# Altium schematic sheet MCU023_MSP432E_GPIO_USB.SchDoc
size 431 x 279 mm; Date: Not shown in title block; ApprovedBy: Not shown in title block; CheckedBy: Not shown in title block; Author: Not shown in title block; CompanyName: Not shown in title block; Engineer: Not shown in title block; Organization: Not shown in title block; Address1: Not shown in title block; Address2: Not shown in title block; Address3: Not shown in title block; Address4: Not shown in title block; DocumentNumber: 1; Revision: Use project parameter SCH_Rev; SheetNumber: 1; SheetTotal: 6; PageSetup: Record=PageOptions|CenterHorizontal=True|CenterVertical=True|PrintScale=1.00|XCorrection=1.00|YCorrection=1.00|PrintKind=0|BorderSize=5000000|LeftOffset=0|BottomOffset=0|Orientation=2|PaperLength=1000|PaperWidth=1000|Scale=100|PaperSource=15|PrintQuality=600|MediaType=1|DitherType=10|PaperKind=Letter|PrintScaleMode=1; CurrentTime: Not shown in title block; CurrentDate: Not shown in title block; Time: Not shown in title block; DocumentFullPathAndName: Not shown in title block; DocumentName: Not shown in title block; ModifiedDate: Not shown in title block; ImagePath: Not shown in title block
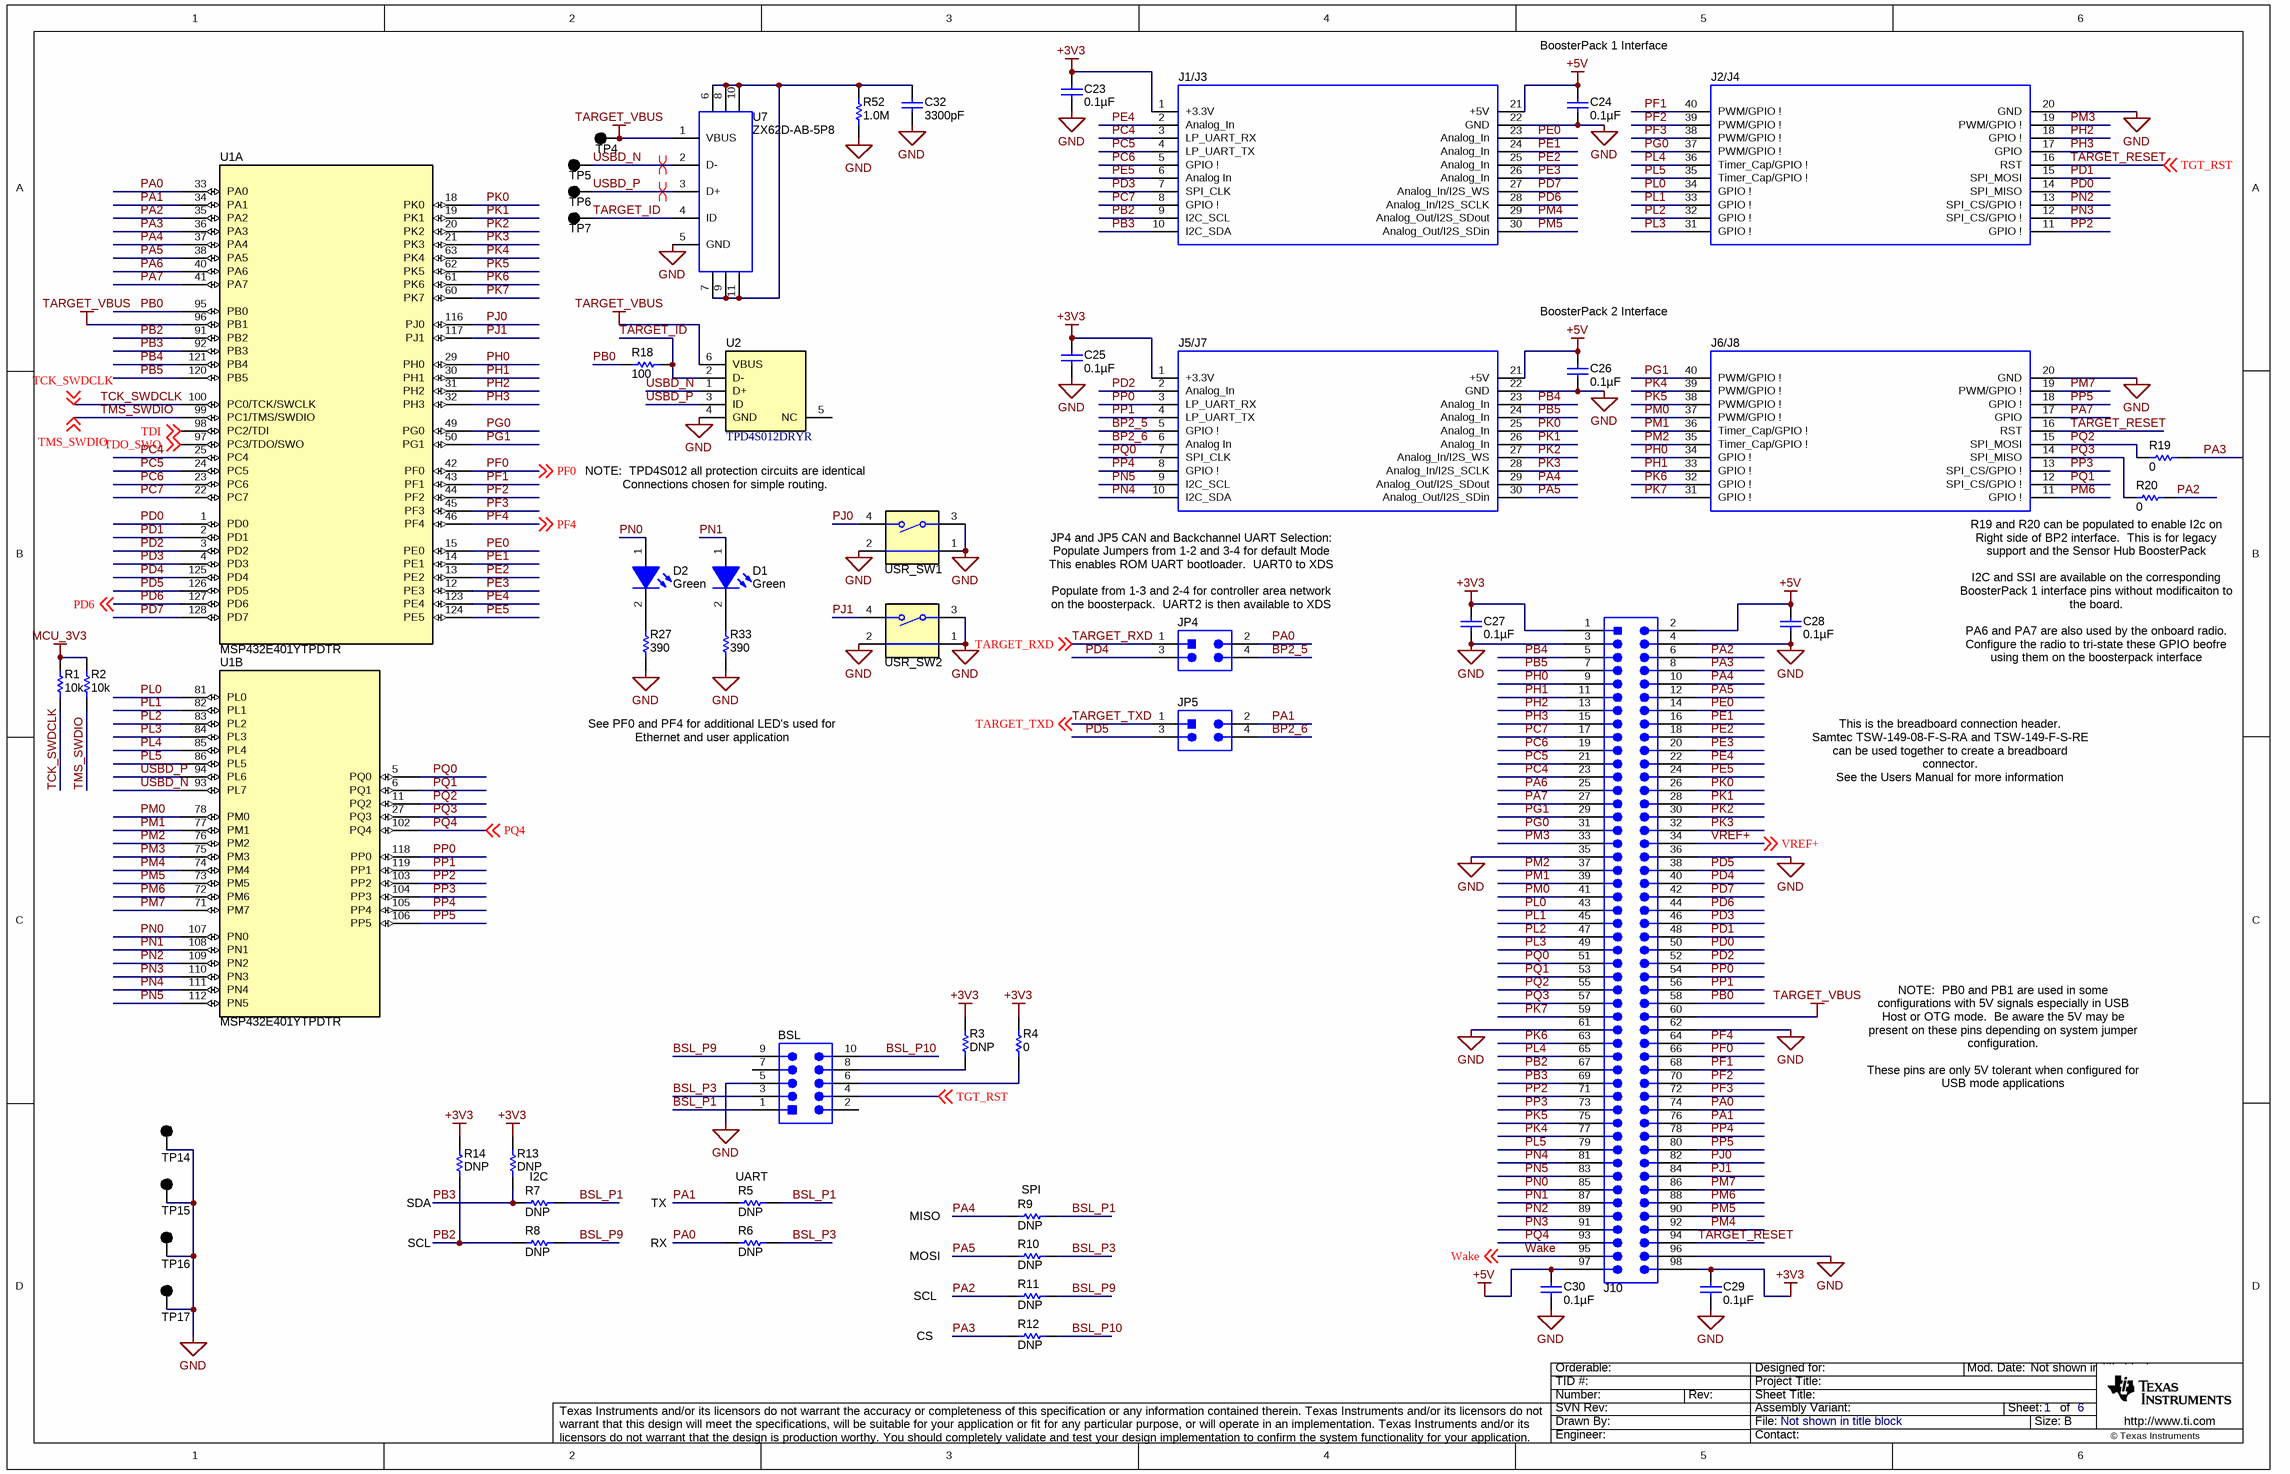
[diagram p0: MCU023_MSP432E_GPIO_USB.SchDoc]

## Parts
BSL  AWHW-10G-0202-T  [Assman_AWHW-10G-0x02-T]  (value not drawn)
C23  ValueDisplayed: 0.1µF  [0402]  (hidden comment: GRM155R71C104KA88D)
C24  ValueDisplayed: 0.1µF  [0402]  (hidden comment: GRM155R71C104KA88D)
C25  ValueDisplayed: 0.1µF  [0402]  (hidden comment: GRM155R71C104KA88D)
C26  ValueDisplayed: 0.1µF  [0402]  (hidden comment: GRM155R71C104KA88D)
C27  ValueDisplayed: 0.1µF  [0402]  (hidden comment: GRM155R71C104KA88D)
C28  ValueDisplayed: 0.1µF  [0402]  (hidden comment: GRM155R71C104KA88D)
C29  ValueDisplayed: 0.1µF  [0402]  (hidden comment: GRM155R71C104KA88D)
C30  ValueDisplayed: 0.1µF  [0402]  (hidden comment: GRM155R71C104KA88D)
C32  ValueDisplayed: 3300pF  [0603]  (hidden comment: GRM188R71H332KA01D)
D1  value Green  [LED_LTST-C190]  (hidden comment: LTST-C190GKT)
D2  value Green  [LED_LTST-C190]  (hidden comment: LTST-C190GKT)
J1/J3  SSQ-110-03-T-D  [BoosterPack_40pin_J1J3]  (value not drawn)
J2/J4  SSQ-110-03-T-D  [BoosterPack_40pin_J2J4]  (value not drawn)
J5/J7  SSQ-110-03-T-D  [BoosterPack_40pin_J1J3]  (value not drawn)
J6/J8  SSQ-110-03-T-D  [BoosterPack_40pin_J2J4]  (value not drawn)
J10  TSW-149-07-S-D  [Samtec_TSW-149-07-x-D]  (value not drawn)
JP4  PBC02DAAN  [Sullins_PxC02DAAN]  (value not drawn)
JP5  PBC02DAAN  [Sullins_PxC02DAAN]  (value not drawn)
R1  ValueDisplayed: 10k  [0402]  (hidden comment: CRCW040210K0JNED)
R2  ValueDisplayed: 10k  [0402]  (hidden comment: CRCW040210K0JNED)
R3  ValueDisplayed: DNP  [0402]  (hidden comment: ERJ-2GE0R00X)
R4  ValueDisplayed: 0  [0402]  (hidden comment: ERJ-2GE0R00X)
R5  ValueDisplayed: DNP  [0402]  (hidden comment: ERJ-2GE0R00X)
R6  ValueDisplayed: DNP  [0402]  (hidden comment: ERJ-2GE0R00X)
R7  ValueDisplayed: DNP  [0402]  (hidden comment: ERJ-2GE0R00X)
R8  ValueDisplayed: DNP  [0402]  (hidden comment: ERJ-2GE0R00X)
R9  ValueDisplayed: DNP  [0402]  (hidden comment: ERJ-2GE0R00X)
R10  ValueDisplayed: DNP  [0402]  (hidden comment: ERJ-2GE0R00X)
R11  ValueDisplayed: DNP  [0402]  (hidden comment: ERJ-2GE0R00X)
R12  ValueDisplayed: DNP  [0402]  (hidden comment: ERJ-2GE0R00X)
R13  ValueDisplayed: DNP  [0402]  (hidden comment: CRCW04023K30JNED)
R14  ValueDisplayed: DNP  [0402]  (hidden comment: CRCW04023K30JNED)
R18  ValueDisplayed: 100  [0402]  (hidden comment: CRCW0402100RJNED)
R19  ValueDisplayed: 0  [0402]  (hidden comment: ERJ-2GE0R00X)
R20  ValueDisplayed: 0  [0402]  (hidden comment: ERJ-2GE0R00X)
R27  ValueDisplayed: 390  [0402]  (hidden comment: CRCW0402390RJNED)
R33  ValueDisplayed: 390  [0402]  (hidden comment: CRCW0402390RJNED)
R52  ValueDisplayed: 1.0M  [0603]  (hidden comment: CRCW06031M00JNEA)
TP4  5001  [Keystone5001]  (value not drawn)
TP5  5001  [Keystone5001]  (value not drawn)
TP6  5001  [Keystone5001]  (value not drawn)
TP7  5001  [Keystone5001]  (value not drawn)
TP14  5001  [Keystone5001]  (value not drawn)
TP15  5001  [Keystone5001]  (value not drawn)
TP16  5001  [Keystone5001]  (value not drawn)
TP17  5001  [Keystone5001]  (value not drawn)
U1  MSP432E401YTPDTR  [PDT0128A]  (parts A,B of 4)
U2  TPD4S012DRYR  [DRY0006A]
U7  ZX62D-AB-5P8  [Hirose-ZX62D-AB-5P8]
USR_SW1  1188E-1K2-V-TR  [SW_1188E]  (value not drawn)
USR_SW2  1188E-1K2-V-TR  [SW_1188E]  (value not drawn)

## Nets
+3V3: C23.2 C25.2 C27.2 C29.2 J1/J3.1(+3.3V) J5/J7.1(+3.3V) J10.1 J10.98 R3.2 R4.2 R13.2 R14.2
+5V: C24.2 C26.2 C28.2 C30.2 J1/J3.21(+5V) J5/J7.21(+5V) J10.2 J10.97
GND: BSL.5 C23.1 C24.1 C25.1 C26.1 C27.1 C28.1 C29.1 C30.1 C32.2 J1/J3.22(GND) J2/J4.20(GND) J5/J7.22(GND) J6/J8.20(GND) J10.3 J10.4 J10.35 J10.36 J10.61 J10.62 J10.96 R27.1 R33.1 R52.1 TP14.1 TP15.1 TP16.1 TP17.1 U2.4(GND) U7.5(GND) USR_SW1.1 USR_SW1.2 USR_SW1.3 USR_SW2.1 USR_SW2.2 USR_SW2.3
MCU_3V3: R1.2 R2.2
TARGET_VBUS: J10.60 TP4.1 U1.96(PB1) U2.6(VBUS) U7.1(VBUS)
BP2_5: J5/J7.5(GPIO_!) JP4.4
BP2_6: J5/J7.6(Analog_In) JP5.4
BSL_P1: BSL.1 R5.1 R7.1 R9.1
BSL_P3: BSL.3 R6.1 R10.1
BSL_P9: BSL.9 R8.1 R11.1
BSL_P10: BSL.10 R12.1
PA0: J10.74 JP4.2 R6.2 U1.33(PA0)
PA1: J10.76 JP5.2 R5.2 U1.34(PA1)
PA2: J10.6 R11.2 R20.2 U1.35(PA2)
PA3: J10.8 R12.2 R19.2 U1.36(PA3)
PA4: J5/J7.29(Analog_Out/I2S_SDout) J10.10 R9.2 U1.37(PA4)
PA5: J5/J7.30(Analog_Out/I2S_SDin) J10.12 R10.2 U1.38(PA5)
PA6: J10.25 U1.40(PA6)
PA7: J6/J8.17(GPIO) J10.27 U1.41(PA7)
PB0: J10.58 R18.1 U1.95(PB0)
PB2: J1/J3.9(I2C_SCL) J10.67 R8.2 R14.1 U1.91(PB2)
PB3: J1/J3.10(I2C_SDA) J10.69 R7.2 R13.1 U1.92(PB3)
PB4: J5/J7.23(Analog_In) J10.5 U1.121(PB4)
PB5: J5/J7.24(Analog_In) J10.7 U1.120(PB5)
PC4: J1/J3.3(LP_UART_RX) J10.23 U1.25(PC4)
PC5: J1/J3.4(LP_UART_TX) J10.21 U1.24(PC5)
PC6: J1/J3.5(GPIO_!) J10.19 U1.23(PC6)
PC7: J1/J3.8(GPIO_!) J10.17 U1.22(PC7)
PD0: J2/J4.14(SPI_MISO) J10.50 U1.1(PD0)
PD1: J2/J4.15(SPI_MOSI) J10.48 U1.2(PD1)
PD2: J5/J7.2(Analog_In) J10.52 U1.3(PD2)
PD3: J1/J3.7(SPI_CLK) J10.46 U1.4(PD3)
PD4: J10.40 JP4.3 U1.125(PD4)
PD5: J10.38 JP5.3 U1.126(PD5)
PD6: J1/J3.28(Analog_In/I2S_SCLK) J10.44 U1.127(PD6) ; off-sheet PD6
PD7: J1/J3.27(Analog_In/I2S_WS) J10.42 U1.128(PD7)
PE0: J1/J3.23(Analog_In) J10.14 U1.15(PE0)
PE1: J1/J3.24(Analog_In) J10.16 U1.14(PE1)
PE2: J1/J3.25(Analog_In) J10.18 U1.13(PE2)
PE3: J1/J3.26(Analog_In) J10.20 U1.12(PE3)
PE4: J1/J3.2(Analog_In) J10.22 U1.123(PE4)
PE5: J1/J3.6(Analog_In) J10.24 U1.124(PE5)
PF0: J10.66 U1.42(PF0) ; off-sheet PF0
PF1: J2/J4.40(PWM/GPIO_!) J10.68 U1.43(PF1)
PF2: J2/J4.39(PWM/GPIO_!) J10.70 U1.44(PF2)
PF3: J2/J4.38(PWM/GPIO_!) J10.72 U1.45(PF3)
PF4: J10.64 U1.46(PF4) ; off-sheet PF4
PG0: J2/J4.37(PWM/GPIO_!) J10.31 U1.49(PG0)
PG1: J6/J8.40(PWM/GPIO_!) J10.29 U1.50(PG1)
PH0: J6/J8.34(GPIO_!) J10.9 U1.29(PH0)
PH1: J6/J8.33(GPIO_!) J10.11 U1.30(PH1)
PH2: J2/J4.18(GPIO_!) J10.13 U1.31(PH2)
PH3: J2/J4.17(GPIO) J10.15 U1.32(PH3)
PJ0: J10.82 U1.116(PJ0) USR_SW1.4
PJ1: J10.84 U1.117(PJ1) USR_SW2.4
PK0: J5/J7.25(Analog_In) J10.26 U1.18(PK0)
PK1: J5/J7.26(Analog_In) J10.28 U1.19(PK1)
PK2: J5/J7.27(Analog_In/I2S_WS) J10.30 U1.20(PK2)
PK3: J5/J7.28(Analog_In/I2S_SCLK) J10.32 U1.21(PK3)
PK4: J6/J8.39(PWM/GPIO_!) J10.77 U1.63(PK4)
PK5: J6/J8.38(PWM/GPIO_!) J10.75 U1.62(PK5)
PK6: J6/J8.32(GPIO_!) J10.63 U1.61(PK6)
PK7: J6/J8.31(GPIO_!) J10.59 U1.60(PK7)
PL0: J2/J4.34(GPIO_!) J10.43 U1.81(PL0)
PL1: J2/J4.33(GPIO_!) J10.45 U1.82(PL1)
PL2: J2/J4.32(GPIO_!) J10.47 U1.83(PL2)
PL3: J2/J4.31(GPIO_!) J10.49 U1.84(PL3)
PL4: J2/J4.36(Timer_Cap/GPIO_!) J10.65 U1.85(PL4)
PL5: J2/J4.35(Timer_Cap/GPIO_!) J10.79 U1.86(PL5)
PM0: J6/J8.37(PWM/GPIO_!) J10.41 U1.78(PM0)
PM1: J6/J8.36(Timer_Cap/GPIO_!) J10.39 U1.77(PM1)
PM2: J6/J8.35(Timer_Cap/GPIO_!) J10.37 U1.76(PM2)
PM3: J2/J4.19(PWM/GPIO_!) J10.33 U1.75(PM3)
PM4: J1/J3.29(Analog_Out/I2S_SDout) J10.92 U1.74(PM4)
PM5: J1/J3.30(Analog_Out/I2S_SDin) J10.90 U1.73(PM5)
PM6: J6/J8.11(GPIO_!) J10.88 U1.72(PM6)
PM7: J6/J8.19(PWM/GPIO_!) J10.86 U1.71(PM7)
PN0: D2.1(A) J10.85 U1.107(PN0)
PN1: D1.1(A) J10.87 U1.108(PN1)
PN2: J2/J4.13(SPI_CS/GPIO_!) J10.89 U1.109(PN2)
PN3: J2/J4.12(SPI_CS/GPIO_!) J10.91 U1.110(PN3)
PN4: J5/J7.10(I2C_SDA) J10.81 U1.111(PN4)
PN5: J5/J7.9(I2C_SCL) J10.83 U1.112(PN5)
PP0: J5/J7.3(LP_UART_RX) J10.54 U1.118(PP0)
PP1: J5/J7.4(LP_UART_TX) J10.56 U1.119(PP1)
PP2: J2/J4.11(GPIO_!) J10.71 U1.103(PP2)
PP3: J6/J8.13(SPI_CS/GPIO_!) J10.73 U1.104(PP3)
PP4: J5/J7.8(GPIO_!) J10.78 U1.105(PP4)
PP5: J6/J8.18(GPIO_!) J10.80 U1.106(PP5)
PQ0: J5/J7.7(SPI_CLK) J10.51 U1.5(PQ0)
PQ1: J6/J8.12(SPI_CS/GPIO_!) J10.53 U1.6(PQ1)
PQ2: J6/J8.15(SPI_MOSI) J10.55 R19.1 U1.11(PQ2)
PQ3: J6/J8.14(SPI_MISO) J10.57 R20.1 U1.27(PQ3)
PQ4: J10.93 U1.102(PQ4) ; off-sheet PQ4
TARGET_ID: R18.2 TP7.1 U2.2(D-) U7.4(ID)
TARGET_RESET: BSL.4 J2/J4.16(RST) J6/J8.16(RST) J10.94 ; off-sheet TGT_RST  [also labelled TGT_RST]
TARGET_RXD: JP4.1 ; off-sheet TARGET_RXD
TARGET_TXD: JP5.1 ; off-sheet TARGET_TXD
TCK_SWDCLK: R1.1 U1.100(PC0/TCK/SWCLK) ; off-sheet TCK_SWDCLK
TDI: U1.98(PC2/TDI) ; off-sheet TDI
TDO_SWO: U1.97(PC3/TDO/SWO) ; off-sheet TDO_SWO
TMS_SWDIO: R2.1 U1.99(PC1/TMS/SWDIO) ; off-sheet TMS_SWDIO
USBD_N: TP5.1 U1.93(PL7) U2.1(D+) U7.2(D-)
USBD_P: TP6.1 U1.94(PL6) U2.3(ID) U7.3(D+)
VREF+: J10.34 ; off-sheet VREF+
Wake: J10.95 ; off-sheet Wake
NetBSL_6: BSL.6 R4.1
NetBSL_8: BSL.8 R3.1
NetC32_1: C32.1 R52.2 U7.6 U7.7 U7.8 U7.9 U7.10 U7.11
NetD1_2: D1.2(K) R33.2
NetD2_2: D2.2(K) R27.2

Not connected (* = marked no-connect by the designer): BSL 2 7; U2 5(NC)

## Layout directives
differential pair: USBD_N, USBD_P

## Notes on the sheet
- BoosterPack 1 Interface
- BoosterPack 2 Interface
- NOTE:  TPD4S012 all protection circuits are identical
- Connections chosen for simple routing.
- (near J5/J7) JP4 and JP5 CAN and Backchannel UART Selection:
- (near J5/J7) Populate Jumpers from 1-2 and 3-4 for default Mode
- This enables ROM UART bootloader.  UART0 to XDS
- R19 and R20 can be populated to enable I2c on
- Right side of BP2 interface.  This is for legacy
- support and the Sensor Hub BoosterPack
- (near JP4) Populate from 1-3 and 2-4 for controller area network
- (near JP4) on the boosterpack.  UART2 is then available to XDS
- I2C and SSI are available on the corresponding
- BoosterPack 1 interface pins without modificaiton to
- the board.
- PA6 and PA7 are also used by the onboard radio.
- Configure the radio to tri-state these GPIO beofre
- using them on the boosterpack interface
- See PF0 and PF4 for additional LED's used for
- Ethernet and user application
- This is the breadboard connection header.
- Samtec TSW-149-08-F-S-RA and TSW-149-F-S-RE
- can be used together to create a breadboard
- connector.
- See the Users Manual for more information
- NOTE:  PB0 and PB1 are used in some
- configurations with 5V signals especially in USB
- Host or OTG mode.  Be aware the 5V may be
- present on these pins depending on system jumper
- configuration.
- These pins are only 5V tolerant when configured for
- USB mode applications
- (near R14) SDA
- I2C
- TX
- (near R5) UART
- MISO
- (near R9) SPI
- SCL
- RX
- MOSI
- CS
- Drawn By:
- SVN Rev:
- Number:
- TID #:
- Orderable:
- Rev:
- Sheet Title:
- File:
- Project Title:
- Designed for:
- Assembly Variant:
- Mod. Date:
- Sheet:
- Size:
- of
- B
- http://www.ti.com
- Texas Instruments and/or its licensors do not warrant the accuracy or completeness of this specification or any information contained therein. Texas Instruments and/or its licensors do not warrant that this design will meet the specifications, will be suitable for your application or fit for any particular purpose, or will operate in an implementation. Texas Instruments and/or its licensors do not warrant that the design is production worthy. You should completely validate and test your design implementation to confirm the system functionality for your application.
- Engineer:
- Contact:
- © Texas Instruments

## Library data of the parts
BSL = AWHW-10G-0202-T: Header(Shrouded), 2.54mm, 5x2, Gold, TH; Manufacturer: Assman WSW; SymbolCreator: a0412235; Pitch_mm: 2.54; Gender: Male; Shrouded: Y; Row_Count: 2; Note: DNP; SymbolVersion: 2013-12-22; PartNumber: AWHW-10G-0202-T; PackageReference: Header, 2.54mm, 5x2, TH; CompType: Header; RoHS: Y; MountType: TH; ComponentLink1Description: Datasheet URL; ComponentLink1URL: http://www.assmann.us/specs/AWHW-xxG-0x02-T.pdf; Orientation: Vertical; PinCount: 10; RowSpacing_mm: 2.54; ContactFinish: Gold; Color: Gray; Publisher: Texas Instruments; LatestRevisionDate: 2016-09-23; Supplier 1: Digi-Key; Supplier Part Number 1: AWHW-10G-0202-T-ND
C23-C30 = GRM155R71C104KA88D: CAP, CERM, 0.1 µF, 16 V, +/- 10%, X7R, 0402; Manufacturer: MuRata; Polarized: N; CompType: Capacitor; Value: 0.1uF; U/M: EA; Cap_F: 0.0000001; Tolerance_%: 10; Value1: Unknown; VDC_V: 16; Value2: 16V; TaMin_C: -55; TaMax_C: 125; SizeArea_mm2: 0.5; SizeAreaWB_mm2: 3; SizeX_mm: 1; SizeZ_mm: 0.6; AEC Category: Q200; SymbolVersion: 2008-07-09; PartNumber: GRM155R71C104KA88D; PackageReference: 0402; RoHS: Y; MountType: SMT; Technology: Ceramic; TempCo: X7R; Cap_Case: 0402; SizeY_mm: 0.5; Published: 2008-06-19; Publisher: Texas Instruments; LatestRevisionDate: 2017-04-07; ComponentLink1Description: Datasheet link; ComponentLink1URL: http://search.murata.co.jp/Ceramy/PnsearchViewAction.do?HnOFG=ON&HnNFG=ON&SEL_CNT=50&sLang=en&sKey=GRM155R71C104KA88D&x=9&y=9&search=startwith; Supplier 1: Digi-Key; Supplier Part Number 1: 490-3261-1-ND; Supplier 2: Newark; Supplier Part Number 2: 38K1647; Supplier 3: Mouser; Supplier Part Number 3: 81-GRM155R71C104KA88; AEC Qualified: ?
C32 = GRM188R71H332KA01D: CAP, CERM, 3300 pF, 50 V, +/- 10%, X7R, 0603; Manufacturer: MuRata; Polarized: N; CompType: Capacitor; Value: 3300pF; U/M: EA; Cap_F: 0.0000000033; Tolerance_%: 10; Value1: Unknown; VDC_V: 50; Value2: 50V; TaMin_C: -55; TaMax_C: 125; SizeArea_mm2: 1.28; SizeAreaWB_mm2: 4.68; SizeX_mm: 1.6; SizeY_mm: 0.8; SizeZ_mm: 1; AEC Category: Q200; SymbolVersion: 2008-07-09; PartNumber: GRM188R71H332KA01D; PackageReference: 0603; RoHS: Y; MountType: SMT; Technology: Ceramic; TempCo: X7R; Cap_Case: 0603; Published: 2008-06-19; Publisher: Texas Instruments; LatestRevisionDate: 2017-04-07; ComponentLink1Description: Datasheet link; ComponentLink1URL: http://search.murata.co.jp/Ceramy/PnsearchViewAction.do?HnOFG=ON&HnNFG=ON&SEL_CNT=50&sLang=en&sKey=GRM188R71H332KA01D&x=9&y=9&search=startwith; Supplier 1: Digi-Key; Supplier Part Number 1: 490-1503-1-ND; Supplier 2: Mouser; Supplier Part Number 2: 81-GRM188R71H332KA; Supplier 3: Farnell; Supplier Part Number 3: 1828914; AEC Qualified: ?
D1 D2 = LTST-C190GKT: LED, Green, SMD; Manufacturer: Lite-On; Vf_V: 2.1; Value2: 2.1V; Io_A: 0.02; Power_TotalModule: 0.1; Value1: 0.1W; U/M: EA; SymbolVersion: 2017-01-11; PartNumber: LTST-C190GKT; PackageReference: 1.6x0.8x0.8mm; RoHS: Y; CompType: LED; Type: ?; MountType: SMT; Color: green; Published: 2008-07-11; Publisher: Texas Instruments; ComponentLink1URL: https://sps06.itg.ti.com/sites/KMS/crossdivteams/altium/docs/ComponentDatasheets/LTST-C190GKT.pdf; ComponentLink1Description: Datasheet link; LatestRevisionDate: 2017-04-02; Supplier 1: Digi-Key; Supplier Part Number 1: 160-1183-1-ND; Supplier 2: Mouser; Supplier Part Number 2: 859-LTST-C190GKT
J1/J3 J5/J7 = BoosterPack_40pin_J1J3: Receptacle, 2.54mm, 10x2, Tin, TH; Manufacturer: Samtec; Alternate Manufacturer: Major League Electronics; Alternate PartNumber: CRD-081413-A-G; SymbolCreator: a0412235; Note: Booster Pack 40 pin J1 and J3; SymbolVersion: 2015-10-21; CompType: Receptacle; PartNumber: SSQ-110-03-T-D; RoHS: Y; PackageReference: 10x2 Receptacle; MountType: TH; ComponentLink1Description: Datasheet Link; Publisher: Texas Instruments; LatestRevisionDate: 2017-04-10; Supplier 1: Digi-Key; Supplier Part Number 1: SAM1204-10-ND
J2/J4 J6/J8 = BoosterPack_40pin_J2J4: Receptacle, 2.54mm, 10x2, Tin, TH; Manufacturer: Samtec; Alternate Manufacturer: Major League Electronics; Alternate PartNumber: CRD-081413-A-G; SymbolCreator: a0412235; Note: Booster Pack 40 pin J2 and J4; SymbolVersion: 2015-10-21; CompType: Receptacle; PartNumber: SSQ-110-03-T-D; RoHS: Y; PackageReference: 10x2 Receptacle; MountType: TH; ComponentLink1Description: Datasheet Link; Publisher: Texas Instruments; LatestRevisionDate: 2017-04-10; Supplier 1: Digi-Key; Supplier Part Number 1: SAM1204-10-ND
J10 = TSW-149-07-S-D: Header, 2.54mm, 49x2, Gold, TH; Manufacturer: Samtec; SymbolCreator: Altium; Pitch_mm: 2.54; Gender: Male; Shrouded: N; Row_Count: 2; Cert_CSA: Y; Note: DNP; SymbolVersion: 2017-04-19; PartNumber: TSW-149-07-S-D; PackageReference: Header, 2.54mm, 49x2, TH; ClassName: Header; CompType: Header; RoHS: Y; MountType: TH; ComponentLink1Description: Datasheet URL; ComponentLink1URL: http://suddendocs.samtec.com/prints/tsw-xxx-xx-xxx-x-xx-xxx-mkt.pdf; Orientation: Vertical; PinCount: 98; RowSpacing_mm: 2.54; ContactFinish: Gold; Color: Black; Cert_UL: Y; Publisher: Texas Instruments; LatestRevisionDate: 2017-04-19; Supplier 1: Digi-Key; Supplier Part Number 1: SAM1032-49-ND
JP4 JP5 = PBC02DAAN: Header, 2.54mm, 2x2, Gold, TH; Manufacturer: Sullins Connector Solutions; SymbolCreator: a0412235; Pitch_mm: 2.54; Gender: Male; Shrouded: N; Row_Count: 2; Current_A: 3; Voltage_V: 1800; Cert_UL: Y; SymbolVersion: 2013-10-31; PartNumber: PBC02DAAN; PackageReference: Header, 2.54mm, 2x2, TH; ClassName: Header; CompType: Header; RoHS: Y; MountType: TH; ComponentLink1Description: Datasheet URL; ComponentLink1URL: http://www.sullinscorp.com/catalogs/77_PAGE108-109_.100_MALE_HDR.pdf; Orientation: Vertical; PinCount: 4; RowSpacing_mm: 2.54; ContactFinish: Gold; Color: Black; Publisher: Texas Instruments; LatestRevisionDate: 2017-03-21; Supplier 1: Digi-Key; Supplier Part Number 1: S2011E-02-ND
R1 R2 = CRCW040210K0JNED: RES, 10 k, 5%, 0.063 W, 0402; Manufacturer: Vishay-Dale; CompType: Resistor; Value: 10k; Res_ohm: 10000; Value_Code: 10k0; Tolerance_%: 5; Power_W: 0.063; Value2: 0.063W; VDC_V: 50; TempCo: 200 ppm/C; SizeArea_mm2: 0.5; SizeX_mm: 1; SizeZ_mm: 0.6; EIA_Code: E24; U/M: EA; AEC Category: Q200; SymbolVersion: 2009-05-29; PartNumber: CRCW040210K0JNED; PackageReference: 0402; RoHS: Y; Value1: 5%; MountType: SMT; Technology: Thick Film; SizeY_mm: 0.5; Published: 2008-06-26; Publisher: Texas Instruments; LatestRevisionDate: 2017-03-27; ComponentLink1Description: Datasheet link; ComponentLink1URL: http://www.vishay.com/docs/20035/dcrcwe3.pdf; Supplier 1: Digi-Key; Supplier Part Number 1: 541-10KJCT-ND; Supplier 2: Newark; Supplier Part Number 2: 59M6696; Supplier 3: Mouser; Supplier Part Number 3: 71-CRCW0402J-10K-E3; AEC Qualified: ?
R3-R12 = ERJ-2GE0R00X: RES, 0, 5%, 0.063 W, 0402; Manufacturer: Panasonic; CompType: Resistor; Value: 0; Value_Code: 0000; Tolerance_%: 5; Power_W: 0.063; Value2: 0.063W; VDC_V: 50; TempCo: 600 ppm/C; SizeArea_mm2: 0.5; SizeX_mm: 1; SizeZ_mm: 0.6; EIA_Code: E24; U/M: EA; AEC Category: Q200; SymbolVersion: 2009-05-29; PartNumber: ERJ-2GE0R00X; PackageReference: 0402; RoHS: Y; Res_ohm: 0; Value1: 5%; MountType: SMT; Technology: Thick Film; SizeY_mm: 0.5; Published: 2008-06-26; Publisher: Texas Instruments; LatestRevisionDate: 2017-03-27; ComponentLink1Description: Datasheet link; ComponentLink1URL: http://www.panasonic.com/industrial/components/pdf/AOA0000CE1.pdf; Supplier 1: Digi-Key; Supplier Part Number 1: P0.0JCT-ND; Supplier 2: Newark; Supplier Part Number 2: 65T8307; Supplier 3: Mouser; Supplier Part Number 3: 667-ERJ-2GE0R00X; AEC Qualified: ?
  R3 R5-R12: Note: DNP
R13 R14 = CRCW04023K30JNED: RES, 3.3 k, 5%, 0.063 W, 0402; Manufacturer: Vishay-Dale; CompType: Resistor; Value: 3.3k; Res_ohm: 3300; Value_Code: 3k30; Tolerance_%: 5; Power_W: 0.063; Value2: 0.063W; VDC_V: 50; TempCo: 200 ppm/C; SizeArea_mm2: 0.5; SizeX_mm: 1; SizeZ_mm: 0.6; EIA_Code: E24; U/M: EA; AEC Category: Q200; SymbolVersion: 2009-05-29; PartNumber: CRCW04023K30JNED; PackageReference: 0402; RoHS: Y; Value1: 5%; MountType: SMT; Technology: Thick Film; SizeY_mm: 0.5; Published: 2008-06-26; Publisher: Texas Instruments; LatestRevisionDate: 2017-04-13; ComponentLink1Description: Datasheet link; ComponentLink1URL: http://www.vishay.com/docs/20035/dcrcwe3.pdf; Supplier 1: Digi-Key; Supplier Part Number 1: 541-3.3KJCT-ND; Supplier 2: Newark; Supplier Part Number 2: 59M6723; Supplier 3: Mouser; Supplier Part Number 3: 71-CRCW0402J-3.3K-E3; AEC Qualified: ?
R18 = CRCW0402100RJNED: RES, 100, 5%, 0.063 W, 0402; Manufacturer: Vishay-Dale; CompType: Resistor; Value: 100; Value_Code: 100R; Tolerance_%: 5; Power_W: 0.063; Value2: 0.063W; VDC_V: 50; TempCo: 200 ppm/C; SizeArea_mm2: 0.5; SizeX_mm: 1; SizeZ_mm: 0.6; EIA_Code: E24; U/M: EA; AEC Category: Q200; SymbolVersion: 2009-05-29; PartNumber: CRCW0402100RJNED; PackageReference: 0402; RoHS: Y; Res_ohm: 100; Value1: 5%; MountType: SMT; Technology: Thick Film; SizeY_mm: 0.5; Published: 2008-06-26; Publisher: Texas Instruments; LatestRevisionDate: 2017-03-27; ComponentLink1Description: Datasheet link; ComponentLink1URL: http://www.vishay.com/docs/20035/dcrcwe3.pdf; Supplier 1: Digi-Key; Supplier Part Number 1: 541-100JCT-ND; Supplier 2: Newark; Supplier Part Number 2: 59M6700; Supplier 3: Mouser; Supplier Part Number 3: 71-CRCW0402J-100-E3; AEC Qualified: ?
R19 R20 = ERJ-2GE0R00X: RES, 0, 5%, 0.063 W, 0402; Manufacturer: Panasonic; CompType: Resistor; Value: 0; Value_Code: 0000; Tolerance_%: 5; Power_W: 0.063; Value2: 0.063W; VDC_V: 50; TempCo: 600 ppm/C; SizeArea_mm2: 0.5; SizeX_mm: 1; SizeZ_mm: 0.6; EIA_Code: E24; U/M: EA; AEC Category: Q200; Note: DNP; SymbolVersion: 2009-05-29; PartNumber: ERJ-2GE0R00X; PackageReference: 0402; RoHS: Y; Res_ohm: 0; Value1: 5%; MountType: SMT; Technology: Thick Film; SizeY_mm: 0.5; Published: 2008-06-26; Publisher: Texas Instruments; LatestRevisionDate: 2017-03-27; ComponentLink1Description: Datasheet link; ComponentLink1URL: http://www.panasonic.com/industrial/components/pdf/AOA0000CE1.pdf; Supplier 1: Digi-Key; Supplier Part Number 1: P0.0JCT-ND; Supplier 2: Newark; Supplier Part Number 2: 65T8307; Supplier 3: Mouser; Supplier Part Number 3: 667-ERJ-2GE0R00X; AEC Qualified: ?
R27 R33 = CRCW0402390RJNED: RES, 390, 5%, 0.063 W, 0402; Manufacturer: Vishay-Dale; CompType: Resistor; Value: 390; Value_Code: 390R; Tolerance_%: 5; Power_W: 0.063; Value2: 0.063W; VDC_V: 50; TempCo: 200 ppm/C; SizeArea_mm2: 0.5; SizeX_mm: 1; SizeZ_mm: 0.6; EIA_Code: E24; U/M: EA; AEC Category: Q200; SymbolVersion: 2009-05-29; PartNumber: CRCW0402390RJNED; PackageReference: 0402; RoHS: Y; Res_ohm: 390; Value1: 5%; MountType: SMT; Technology: Thick Film; SizeY_mm: 0.5; Published: 2008-06-26; Publisher: Texas Instruments; LatestRevisionDate: 2017-03-27; ComponentLink1Description: Datasheet link; ComponentLink1URL: http://www.vishay.com/docs/20035/dcrcwe3.pdf; Supplier 1: Digi-Key; Supplier Part Number 1: 541-390JCT-ND; Supplier 2: Newark; Supplier Part Number 2: 59M6731; Supplier 3: Mouser; Supplier Part Number 3: 71-CRCW0402J-390-E3; AEC Qualified: ?
R52 = CRCW06031M00JNEA: RES, 1.0 M, 5%, 0.1 W, 0603; Manufacturer: Vishay-Dale; CompType: Resistor; Value: 1.0Meg; Res_ohm: 1000000; Value_Code: 1M00; Tolerance_%: 5; Power_W: 0.1; Value2: 0.1W; VDC_V: 75; TempCo: 200 ppm/C; SizeArea_mm2: 1.28; SizeX_mm: 1.6; SizeY_mm: 0.8; SizeZ_mm: 1; EIA_Code: E24; U/M: EA; AEC Category: Q200; SymbolVersion: 2009-05-29; PartNumber: CRCW06031M00JNEA; PackageReference: 0603; RoHS: Y; Value1: 5%; MountType: SMT; Technology: Thick Film; Published: 2008-06-26; Publisher: Texas Instruments; LatestRevisionDate: 2017-03-04; ComponentLink1Description: Datasheet link; ComponentLink1URL: http://www.vishay.com/docs/20035/dcrcwe3.pdf; Supplier 1: Digi-Key; Supplier Part Number 1: 541-1.0MGCT-ND; Supplier 2: Newark; Supplier Part Number 2: 59M6756; Supplier 3: Mouser; Supplier Part Number 3: 71-CRCW0603J-1.0M-E3; AEC Qualified: ?
TP4-TP7 TP14-TP17 = 5001: Test Point, Miniature, Black, TH; Manufacturer: Keystone; CompType: Test Point Loop; U/M: EA; Note: DNP; SymbolVersion: 2008-04-04; PartNumber: 5001; PackageReference: Black Miniature Testpoint; RoHS: Y; MountType: TH; ComponentLink1Description: Datasheet Link; ComponentLink1URL: http://www.keyelco.com/userAssets/file/M60-2p60.pdf; Value: Black; Publisher: Texas Instruments; LatestRevisionDate: 2015-08-25; Supplier 1: Digi-Key; Supplier Part Number 1: 36-5001-ND
U1 = TM4C1294NCPDTI3R: IoT enabled High performance 32-bit ARM(R) Cortex(R)-M4F based MCU, PDT0128A (TQFP-128); Manufacturer: Texas Instruments; SymbolCreator: a0411947; SizeArea_mm2: 256; SizeAreaWB_mm2: 324; SizeX_mm: 16; SizeZ_mm: 1.2; CompType: IC; U/M: EA; Note: TI Supplied; SymbolVersion: 2015-10-15; PartNumber: MSP432E401YTPDTR; PackageReference: PDT0128A; PackageDescription: TQFP-128; MountType: SMT; SizeY_mm: 16; ComponentLink1Description: Datasheet Link; ComponentLink1URL: http://www.ti.com/lit/ds/symlink/tm4c1294ncpdt.pdf; RoHS: Y; Publisher: Texas Instruments; LatestRevisionDate: 2017-03-30
U2 = TPD4S012DRYR: USB ESD Solution with Power Clamp, 4 Channels, -40 to +85 degC, 6-pin SON (DRY), Green (RoHS & no Sb/Br); Manufacturer: Texas Instruments; Alternate PartNumber: Equivalent; Breakdown Voltage(Min)(V): 6; IEC 61000-4-2 Air-Gap(+/- kV): 10; IO Capacitance(Typ)(pF): 0.8; USB High Speed: TRUE; Note: TI Supplied; DatasheetVersion: SLVS928A; PackageVersion: revF, Dec-2011; PackageReference: DRY0006A; PackageDescription: 6-Pin Plastic Small Outline No-Lead, 1 x 1.45 x 0.6 mm Body, 0.5 mm Pitch; Supplier 1: Digi-Key; Supplier Part Number 1: 296-24244-2-ND; Supplier 2: Digi-Key; Supplier Part Number 2: 296-24244-1-ND; Supplier 3: Digi-Key; Supplier Part Number 3: 296-24244-6-ND; Supplier 4: Farnell; Supplier Part Number 4: 1755332; Supplier 5: Newark; Supplier Part Number 5: 73P5280; Supplier 6: Mouser; Supplier Part Number 6: 595-TPD4S012DRYR; Eco-Plan: Green (RoHS & no Sb/Br); IEC 61000-4-2 Contact(+/- kV): 10; IO Leakage Current(nA): 10; SubFamily: ESD Solution; MountType: SMT; PartNumber: TPD4S012DRYR; ComponentLink1Description: Datasheet; ComponentLink1URL: http://www.ti.com/general/docs/lit/getliterature.tsp?genericPartNumber=TPD4S012&fileType=pdf; ComponentLink2Description: URL Link1; ComponentLink2URL: SamplesURL:http://www.ti.com/product/tpd4s012#samples; Alternate Manufacturer: Texas Instruments
U7 = ZX62D-AB-5P8: Connector, Receptacle, Micro-USB Type AB, R/A, Bottom Mount SMT; Manufacturer: Hirose Electric Co. Ltd.; SymbolCreator: a0411947; Green_Lifecycle: Not Set; Green_REACh: Incomplete; SymbolVersion: 2013-06-26; PartNumber: ZX62D-AB-5P8; PackageReference: Connector, Receptacle, Micro-USB Type AB, R/A, Bottom Mount SMT; CompType: Receptacle; RoHS: Y; MountType: SMT; ComponentLink1Description: Datasheet URL; ComponentLink1URL: http://www.hirose.co.jp/cataloge_hp/ed_ZX_20140804.pdf; Publisher: Texas Instruments; LatestRevisionDate: 2017-05-09; Supplier 1: Digi-Key; Supplier Part Number 1: H11494CT-ND; Supplier 2: Newark; Supplier Part Number 2: 69W0711; Supplier 3: Mouser; Supplier Part Number 3: 798-ZX62D-AB-5P8; Green_EU RoHS: Incomplete; Green_EU RoHS-2: Incomplete
USR_SW1 USR_SW2 = 1188E-1K2-V-TR: Switch, SPST, 0.05 A, 12 VDC, SMD; Manufacturer: Diptronics; SymbolCreator: Altium; SizeAreaWB_mm2: 53.9; SizeArea_mm2: 27.3; SizeX_mm: 7.8; SizeY_mm: 3.5; VDC_V: 12; PositionCount: 1; CurrentRating_mA: 50; SymbolVersion: 2017-02-06; PartNumber: 1188E-1K2-V-TR; MountType: SMT; SizeZ_mm: 3.5; ComponentLink1Description: Datasheet URL; ComponentLink1URL: http://www.dip.com.tw/en/en-product-information/en-switch004/item/download/1976_b080c057386714e3a6604cbe658b9df3; RoHS: Y; Circuit: SPST; Orientation: Side Actuated; CompType: Switch; PackageReference: 7.8x3.5mm; Publisher: Texas Instruments; LatestRevisionDate: 2017-04-05